# EAGLE schematic Outlet_Sensor (EAGLE 7.5.0)
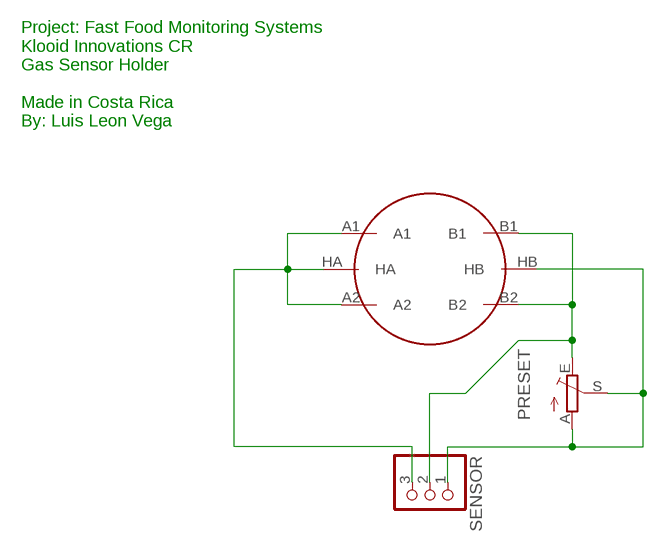
[diagram p0: schematic, sheet 1]

## Parts
PRESET  TRIM_EU-B25P  [B25P]
SENSOR  PINHD-1X3  [1X03]
U$1  METHANE_SENSOR  [MQ-3]

## Nets
GND: PRESET.A PRESET.S SENSOR.1 U$1.HB
N$1: SENSOR.3 U$1.A1 U$1.A2 U$1.HA
N$4: PRESET.E SENSOR.2 U$1.B1 U$1.B2

## Notes on the sheet
- Project: Fast Food Monitoring Systems
  Klooid Innovations CR
  Gas Sensor Holder
  
  Made in Costa Rica
  By: Luis Leon Vega

## Library data of the parts
PRESET = pot:TRIM_EU-: POTENTIOMETER
SENSOR = adafruit:PINHD-1X3: PIN HEADER
U$1 = SparkFun-Sensors:METHANE_SENSOR: MQ-4 Methane Gas Sensor SEN-09404